# Altium project Pallette FR4.PrjPcb
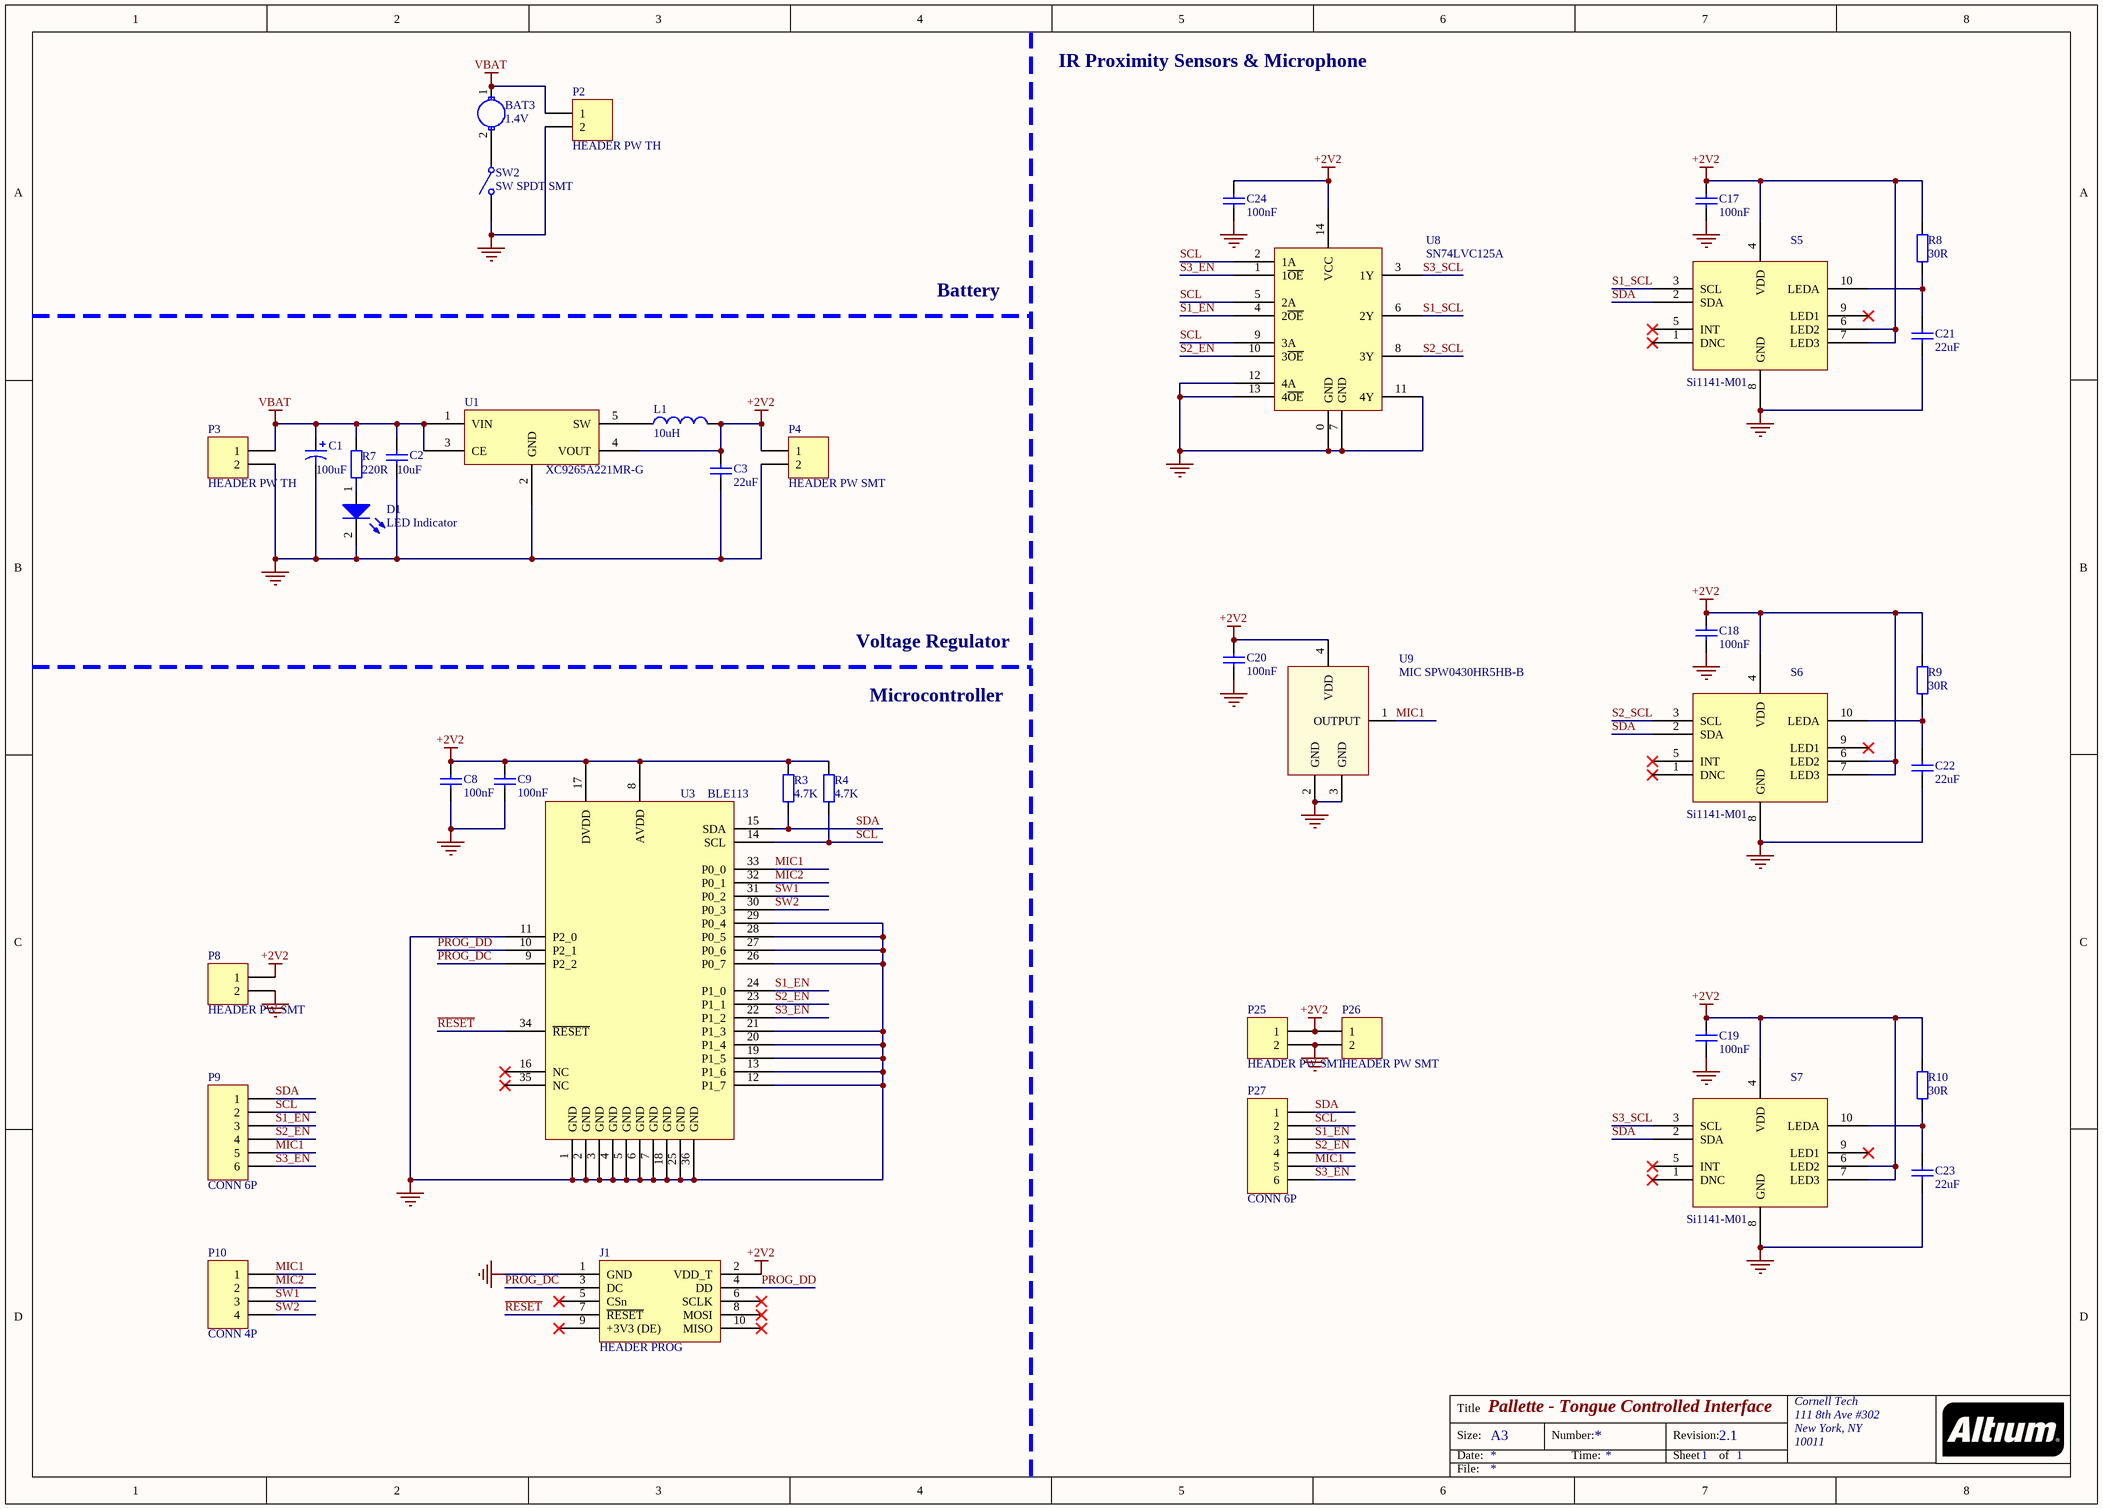
[diagram p0: Pallette v2.1.SchDoc]
Title: Pallette
1 sheet, 40 parts. Net scope: global (net labels, ports and power ports of the same name join across sheets).
Board file: Pallette v2.1.PcbDoc

## Sheet Pallette v2.1.SchDoc: Pallette - Tongue Controlled Interface
size A3; Author: Joanna Zhang; Organization: Cornell Tech; Address1: 111 8th Ave #302; Address2: New York, NY; Address3: 10011; Revision: 2.1; SheetNumber: 1; SheetTotal: 1; ProjectName: Pallette

### Parts
BAT3  value 1.4V  [BAT RETAINER 13]  (hidden comment: BAT RETAINER 13)
C1  100uF  [1411]
C2  10uF  [0603]
C3  22uF  [0603]
C8  100nF  [0402]
C9  100nF  [0402]
C17  100nF  [0402]
C18  100nF  [0402]
C19  100nF  [0402]
C20  100nF  [0402]
C21  22uF  [0603]
C22  22uF  [0603]
C23  22uF  [0603]
C24  100nF  [0402]
D1  LED Indicator  [LED]
J1  HEADER PROG  [TC2050-IDC-NL]  (no BOM)
L1  10uH  [0805]
P2  HEADER PW TH  [PORT PW TH 2P]  (no BOM)
P3  HEADER PW TH  [PORT PW TH 2P]  (no BOM)
P4  HEADER PW SMT  [PORT PW SMT 2P]  (no BOM)
P8  HEADER PW SMT  [PORT PW SMT 2P]  (no BOM)
P9  CONN 6P  [PORT CONN 6P]  (no BOM)
P10  CONN 4P  [PORT CONN 4P]  (no BOM)
P25  HEADER PW SMT  [PORT PW SMT 2P]  (no BOM)
P26  HEADER PW SMT  [PORT PW SMT 2P]  (no BOM)
P27  CONN 6P  [PORT CONN 6P]  (no BOM)
R3  4.7K  [0402]
R4  4.7K  [0402]
R7  220R  [0603]
R8  30R  [0402]
R9  30R  [0402]
R10  30R  [0402]
S5  Si1141-M01  [SI1141-M01]
S6  Si1141-M01  [SI1141-M01]
S7  Si1141-M01  [SI1141-M01]
SW2  SW SPDT SMT  [SW SPDT SMT]
U1  XC9265A221MR-G  [SOT-25]
U3  BLE113  [BLE113-A]
U8  SN74LVC125A  [VQFN14]
U9  MIC SPW0430HR5HB-B  [MIC-4P]

### Nets
+2V2: C3.2 C8.2 C9.2 C17.2 C18.2 C19.2 C20.1 C24.2 J1.2(VDD_T) L1.2 P4.1 P8.1 P25.1 P26.1 R3.2 R4.2 R8.2 R9.2 R10.2 S5.4(VDD) S5.6(LED2) S5.7(LED3) S6.4(VDD) S6.6(LED2) S6.7(LED3) S7.4(VDD) S7.6(LED2) S7.7(LED3) U1.4(VOUT) U3.8(AVDD) U3.17(DVDD) U8.14(VCC) U9.4(VDD)
GND: C1.2 C2.1 C3.1 C8.1 C9.1 C17.1 C18.1 C19.1 C20.2 C21.1 C22.1 C23.1 C24.1 D1.2(K) J1.1(GND) P2.2 P3.2 P4.2 P8.2 P25.2 P26.2 S5.8(GND) S6.8(GND) S7.8(GND) SW2.2(NO) U1.2(GND) U3.1(GND) U3.2(GND) U3.3(GND) U3.4(GND) U3.5(GND) U3.6(GND) U3.7(GND) U3.11(P2_0) U3.12(P1_7) U3.13(P1_6) U3.18(GND) U3.19(P1_5) U3.20(P1_4) U3.21(P1_3) U3.25(GND) U3.26(P0_7) U3.27(P0_6) U3.28(P0_5) U3.29(P0_4) U3.36(GND) U8.0(GND) U8.7(GND) U8.11(4Y) U8.12(4A) U8.13(4~{OE}) U9.2(GND) U9.3(GND)
VBAT: BAT3.1(+) C1.1 C2.2 P2.1 P3.1 R7.2 U1.1(VIN) U1.3(CE)
MIC1: P9.5 P10.1 P27.5 U3.33(P0_0) U9.1(OUTPUT)
MIC2: P10.2 U3.32(P0_1)
PROG_DC: J1.3(DC) U3.9(P2_2)
PROG_DD: J1.4(DD) U3.10(P2_1)
~{RESET}: J1.7(~{RESET}) U3.34(~{RESET})
S1_EN: P9.3 P27.3 U3.24(P1_0) U8.4(2~{OE})
S1_SCL: S5.3(SCL) U8.6(2Y)
S2_EN: P9.4 P27.4 U3.23(P1_1) U8.10(3~{OE})
S2_SCL: S6.3(SCL) U8.8(3Y)
S3_EN: P9.6 P27.6 U3.22(P1_2) U8.1(1~{OE})
S3_SCL: S7.3(SCL) U8.3(1Y)
SCL: P9.2 P27.2 R4.1 U3.14(SCL) U8.2(1A) U8.5(2A) U8.9(3A)
SDA: P9.1 P27.1 R3.1 S5.2(SDA) S6.2(SDA) S7.2(SDA) U3.15(SDA)
SW1: P10.3 U3.31(P0_2)
SW2: P10.4 U3.30(P0_3)
NetBAT3_2: BAT3.2(-) SW2.1(COMMON)
NetC21_2: C21.2 R8.1 S5.10(LEDA)
NetC22_2: C22.2 R9.1 S6.10(LEDA)
NetC23_2: C23.2 R10.1 S7.10(LEDA)
NetD1_1: D1.1(A) R7.1
NetL1_1: L1.1 U1.5(SW)

Not connected (* = marked no-connect by the designer): J1 5(CSn)* 6(SCLK)* 8(MOSI)* 9(+3V3_(DE))* 10(MISO)*; S5 1(DNC)* 5(INT)* 9(LED1)*; S6 1(DNC)* 5(INT)* 9(LED1)*; S7 1(DNC)* 5(INT)* 9(LED1)*; U3 16(NC)* 35(NC)*

### Notes on the sheet
- IR Proximity Sensors & Microphone
- Battery
- Voltage Regulator
- Microcontroller
- Title
- Size:
- Date:
- A3
- Number:
- Time:
- Revision:
- Sheet
- of
- File:

### Library data of the parts
BAT3 = BAT RETAINER 13: RETAINER COIN CELL SMD 7.9MM; Manufacturer: Keystone Electronics; Manufacturer Part Number: 2988; Digi-Key Part Number: 36-2988-ND
C1 = Cap Pol 100uF: CAP TANT POLY 100UF 8V 1411; Manufacturer: Panasonic Electronic Components; Manufacturer Part Number: 8TPE100MAZB; Digi-Key Part Number: P16641CT-ND; Value: 100uF
C2 = CAP 10uF: CAP CER 10UF ±20% 10V X5R 0603; Manufacturer Part Number: GRM188R61A106MAALD; Manufacturer: Murata; Digi-Key Part Number: 490-12734-1-ND; Value: 10uF
C3 C21 = CAP 22uF: CAP CER 22UF 6.3V X5R 0603; Manufacturer Part Number: GRM188R60J226MEA0D; Manufacturer: Murata; Digi-Key Part Number: 490-7611-1-ND; Value: 22uF
C8 C9 C17-C20 C24 = Cap 100nF: CAP CER 0.1UF 10V X5R 0402; Manufacturer: Murata; Manufacturer Part Number: GRM155R61A104KA01D; Digi-Key Part Number: 490-1318-1-ND; Value: 100nF
C22 C23 = Cap 22uF: CAP CER 22UF 6.3V X5R 0603; Manufacturer Part Number: GRM188R60J226MEA0D; Manufacturer: Murata; Digi-Key Part Number: 490-7611-1-ND; Value: 22uF
D1 = LED Indicator: LED Red 630nm 2.2V Diffused White Lens 0603; Manufacturer Part Number: SML-D12V1WT86; Manufacturer: Rohm Semiconductor; Digikey Part Number: SML-D12V1WT86CT-ND
J1 = HEADER PROG: PADS PROGRAMMING
L1 = IND 10uH: FIXED IND 10UH 500MA 320 MOHM; Manufacturer: Abracon LLC; Manufacturer Part Number: AIML-0805HC-100M-T; Digi-Key Part Number: 535-12791-1-ND; Value: 10uH
P2 P3 = HEADER PW TH: PADS POWER; LatestRevisionDate: 17-Jul-2002; LatestRevisionNote: Re-released for DXP Platform.; Publisher: Altium Limited
P4 P8 P25 P26 = HEADER PW SMT: Connection Port; LatestRevisionDate: 17-Jul-2002; LatestRevisionNote: Re-released for DXP Platform.; Publisher: Altium Limited
P9 P27 = HEADER CONN 6P: Connection Port; LatestRevisionDate: 17-Jul-2002; LatestRevisionNote: Re-released for DXP Platform.; Publisher: Altium Limited
P10 = HEADER CONN 4P: Connection Port; LatestRevisionDate: 17-Jul-2002; LatestRevisionNote: Re-released for DXP Platform.; Publisher: Altium Limited
R3 R4 = Res 4.7K: RES SMD 4.7K OHM 1% 1/16W 0402; Manufacturer: Yageo; Manufacturer Part Number: RC0402FR-074K7L; Digi-Key Part Number: 311-4.7KLRCT-ND
R7 = RES 220R: RES SMD 220 OHM 1% 1/10W 0603; Manufacturer: Panasonic; Manufacturer Part Number: ERJ-3EKF2200V; Digi-Key Part Number: P220HCT-ND
R8-R10 = Res 30R: RES SMD 30 OHM 1% 1/16W 0402; Manufacturer: Yageo; Manufacturer Part Number: RC0402FR-0730RL; Digi-Key Part Number: 311-30LRCT-ND
S5-S7 = Si1141-M01: SENS IR PROXIMITY AMB LT 10QFN; Manufacturer: Silicon Labs; Manufacturer Part Number: SI1141-M01-GMR; Digi-Key Part Number: 336-3260-1-ND
SW2 = SW SPDT SMT: SW Single-Pole Double-Throw SMT Right-Angle; Manufacturer: C&K Components; Manufacturer Part Number: JS202011AQN; Digikey Part Number: 401-2000-ND
U1 = VR XC9265A221MR-G: IC REG BUCK 2.2V 0.2A SYNC SOT25; Manufacturer: Torex Semiconductor Ltd; Digi-Key Part Number: 893-1305-1-ND; Manufacturer Part Number: XC9265A221MR-G
U3 = uC BLE113: MODULE BT 4.0 BLE113 OTA; Manufacturer: Silicon Labs; Manufacturer Part Number: BLE113-A-M256K; Digi-Key Part Number: 1446-1035-1-ND
U8 = BUFF SN74LVC125A: IC BUS BUFF TRI-ST QD 14VQFN; Manufacturer: Texas Instruments; Manufacturer Part Number: SN74LVC125ARGYR; Digi-Key Part Number: 296-13961-1-ND
U9 = MIC SPW0430HR5HB-B: MIC MEMS ANALOG OMNI; Manufacturer: Knowles; Digi-Key Part Number: 423-1215-1-ND; Manufacturer Part Number: SPW0430HR5HB-B